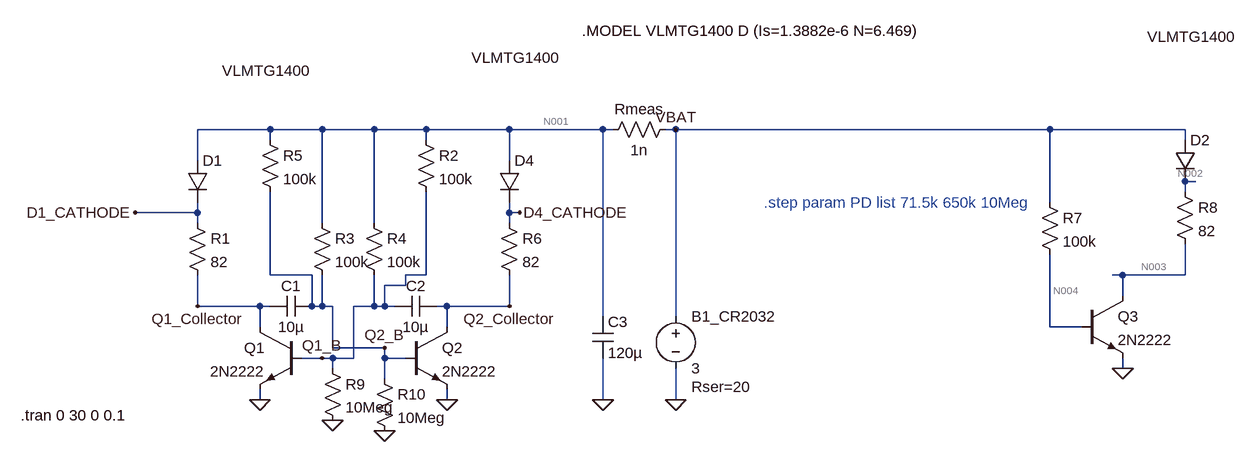
[diagram p0: schematic FWA_2020-2022_Compass_Multivibrator_Sim.asc]
FWA_2020-2022_Compass_Multivibrator_Sim.asc, the LTspice schematic file:
Version 4
SHEET 1 1716 680
WIRE 112 -144 0 -144
WIRE 192 -144 112 -144
WIRE 272 -144 192 -144
WIRE 352 -144 272 -144
WIRE 480 -144 352 -144
WIRE 624 -144 480 -144
WIRE 640 -144 624 -144
WIRE 736 -144 720 -144
WIRE 1312 -144 736 -144
WIRE 1520 -144 1312 -144
WIRE 112 -128 112 -144
WIRE 352 -128 352 -144
WIRE 1520 -128 1520 -144
WIRE 0 -96 0 -144
WIRE 480 -96 480 -144
WIRE 1520 -64 1520 -80
WIRE 1536 -64 1520 -64
WIRE 1520 -48 1520 -64
WIRE 1312 -32 1312 -144
WIRE 0 -16 0 -32
WIRE 0 -16 -96 -16
WIRE 480 -16 480 -32
WIRE 496 -16 480 -16
WIRE 0 0 0 -16
WIRE 192 0 192 -144
WIRE 272 0 272 -144
WIRE 480 0 480 -16
WIRE 112 80 112 -48
WIRE 176 80 112 80
WIRE 352 80 352 -48
WIRE 352 80 320 80
WIRE 1424 80 1408 80
WIRE 1520 80 1520 32
WIRE 1520 80 1424 80
WIRE 320 96 320 80
WIRE 320 96 288 96
WIRE 1424 112 1424 80
WIRE 0 128 0 80
WIRE 96 128 0 128
WIRE 112 128 96 128
WIRE 176 128 176 80
WIRE 192 128 192 80
WIRE 192 128 176 128
WIRE 208 128 192 128
WIRE 272 128 272 80
WIRE 272 128 240 128
WIRE 288 128 288 96
WIRE 288 128 272 128
WIRE 304 128 288 128
WIRE 384 128 368 128
WIRE 480 128 480 80
WIRE 480 128 384 128
WIRE 624 144 624 -144
WIRE 736 144 736 -144
WIRE 96 160 96 128
WIRE 384 160 384 128
WIRE 1312 160 1312 48
WIRE 1360 160 1312 160
WIRE 208 192 208 128
WIRE 288 192 208 192
WIRE 192 208 160 208
WIRE 208 208 192 208
WIRE 240 208 240 128
WIRE 240 208 208 208
WIRE 288 208 288 192
WIRE 320 208 288 208
WIRE 208 224 208 208
WIRE 1424 224 1424 208
WIRE 288 240 288 208
WIRE 96 272 96 256
WIRE 384 272 384 256
WIRE 624 272 624 208
WIRE 736 272 736 224
FLAG 96 272 0
FLAG 384 272 0
FLAG 736 272 0
FLAG 736 -144 VBAT
FLAG -96 -16 D1_CATHODE
FLAG 496 -16 D4_CATHODE
FLAG 0 128 Q1_Collector
FLAG 480 128 Q2_Collector
FLAG 192 208 Q1_B
FLAG 288 192 Q2_B
FLAG 624 272 0
FLAG 1424 224 0
FLAG 208 304 0
FLAG 288 320 0
SYMBOL npn 160 160 M0
SYMATTR InstName Q1
SYMATTR Value 2N2222
SYMBOL npn 320 160 R0
SYMATTR InstName Q2
SYMATTR Value 2N2222
SYMBOL res -16 -16 R0
SYMATTR InstName R1
SYMATTR Value 82
SYMBOL res 176 -16 R0
SYMATTR InstName R3
SYMATTR Value 100k
SYMBOL res 256 -16 R0
SYMATTR InstName R4
SYMATTR Value 100k
SYMBOL voltage 736 128 R0
WINDOW 123 0 0 Left 0
WINDOW 39 24 124 Left 2
SYMATTR SpiceLine Rser=20
SYMATTR InstName B1_CR2032
SYMATTR Value 3
SYMBOL diode -16 -96 R0
WINDOW 3 54 -139 Left 2
SYMATTR Value VLMTG1400
SYMATTR InstName D1
SYMBOL res 464 -16 R0
SYMATTR InstName R6
SYMATTR Value 82
SYMBOL diode 464 -96 R0
WINDOW 3 -42 -159 Left 2
SYMATTR Value VLMTG1400
SYMATTR InstName D4
SYMBOL cap 176 112 R90
WINDOW 0 0 32 VBottom 2
WINDOW 3 32 32 VTop 2
SYMATTR InstName C1
SYMATTR Value 10µ
SYMBOL cap 368 112 R90
WINDOW 0 0 32 VBottom 2
WINDOW 3 32 32 VTop 2
SYMATTR InstName C2
SYMATTR Value 10µ
SYMBOL cap 608 144 R0
SYMATTR InstName C3
SYMATTR Value 120µ
SYMBOL res 336 -144 R0
SYMATTR InstName R2
SYMATTR Value 100k
SYMBOL res 96 -144 R0
SYMATTR InstName R5
SYMATTR Value 100k
SYMBOL res 1296 -48 R0
SYMATTR InstName R7
SYMATTR Value 100k
SYMBOL res 1504 -64 R0
SYMATTR InstName R8
SYMATTR Value 82
SYMBOL npn 1360 112 R0
SYMATTR InstName Q3
SYMATTR Value 2N2222
SYMBOL diode 1504 -128 R0
WINDOW 3 -42 -159 Left 2
SYMATTR Value VLMTG1400
SYMATTR InstName D2
SYMBOL res 192 208 R0
SYMATTR InstName R9
SYMATTR Value 10Meg
SYMBOL res 272 224 R0
SYMATTR InstName R10
SYMATTR Value 10Meg
SYMBOL res 736 -160 R90
WINDOW 0 0 56 VBottom 2
WINDOW 3 32 56 VTop 2
SYMATTR InstName Rmeas
SYMATTR Value 1n
TEXT -272 296 Left 2 !.tran 0 30 0 0.1
TEXT 872 -32 Left 2 ;.step param PD list 71.5k 650k 10Meg
TEXT 592 -296 Left 2 !.MODEL VLMTG1400 D (Is=1.3882e-6 N=6.469)

The netlist it stands for:
* FWA_2020-2022_Compass_Multivibrator_Sim.asc
Q1 Q1_Collector Q1_B 0 0 2N2222
Q2 Q2_Collector Q2_B 0 0 2N2222
R1 D1_CATHODE Q1_Collector 82
R3 N001 Q2_B 100k
R4 N001 Q1_B 100k
V§B1_CR2032 VBAT 0 3 Rser=20
D1 N001 D1_CATHODE VLMTG1400
R6 D4_CATHODE Q2_Collector 82
D4 N001 D4_CATHODE VLMTG1400
C1 Q2_B Q1_Collector 10µ
C2 Q2_Collector Q1_B 10µ
C3 N001 0 120µ
R2 N001 Q1_B 100k
R5 N001 Q2_B 100k
R7 VBAT N004 100k
R8 N002 N003 82
Q3 N003 N004 0 0 2N2222
D2 VBAT N002 VLMTG1400
R9 Q1_B 0 10Meg
R10 Q2_B 0 10Meg
Rmeas VBAT N001 1n
.model D D
.lib standard.dio
.model NPN NPN
.model PNP PNP
.lib standard.bjt
.tran 0 30 0 0.1
* .step param PD list 71.5k 650k 10Meg
.MODEL VLMTG1400 D (Is=1.3882e-6 N=6.469)
.backanno
.end

* Results of the author's LTspice run, read from the files saved beside the schematic
* Operating Point, zero values left out:
*   V(q1_collector) = 576.1 mV
*   V(q1_b) = 709.6 mV
*   V(q2_collector) = 576.1 mV
*   V(q2_b) = 709.6 mV
*   V(d1_cathode) = 1.187 V
*   V(n001) = 2.624 V
*   V(vbat) = 2.624 V
*   V(d4_cathode) = 1.187 V
*   V(n004) = 691.1 mV
*   V(n002) = 1.298 V
*   V(n003) = 984.2 mV
*   Ic(Q3) = 3.828 mA
*   Ib(Q3) = 19.33 µA
*   Ie(Q3) = -3.847 mA
*   Ic(Q2) = 7.447 mA
*   Ib(Q2) = 38.21 µA
*   Ie(Q2) = -7.485 mA
*   Ic(Q1) = 7.447 mA
*   Ib(Q1) = 38.21 µA
*   Ie(Q1) = -7.485 mA
*   I(D2) = 3.828 mA
*   I(D4) = 7.447 mA
*   I(D1) = 7.447 mA
*   I(Rmeas) = 14.97 mA
*   I(R10) = 70.96 nA
*   I(R9) = 70.96 nA
*   I(R8) = 3.828 mA
*   I(R7) = 19.33 µA
*   I(R5) = 19.14 µA
*   I(R2) = 19.14 µA
*   I(R6) = 7.447 mA
*   I(R4) = 19.14 µA
*   I(R3) = 19.14 µA
*   I(R1) = 7.447 mA
*   I(B1_cr2032) = -18.82 mA